# EAGLE design TR_i3_6A_Module_v5 (EAGLE 9.4.1)
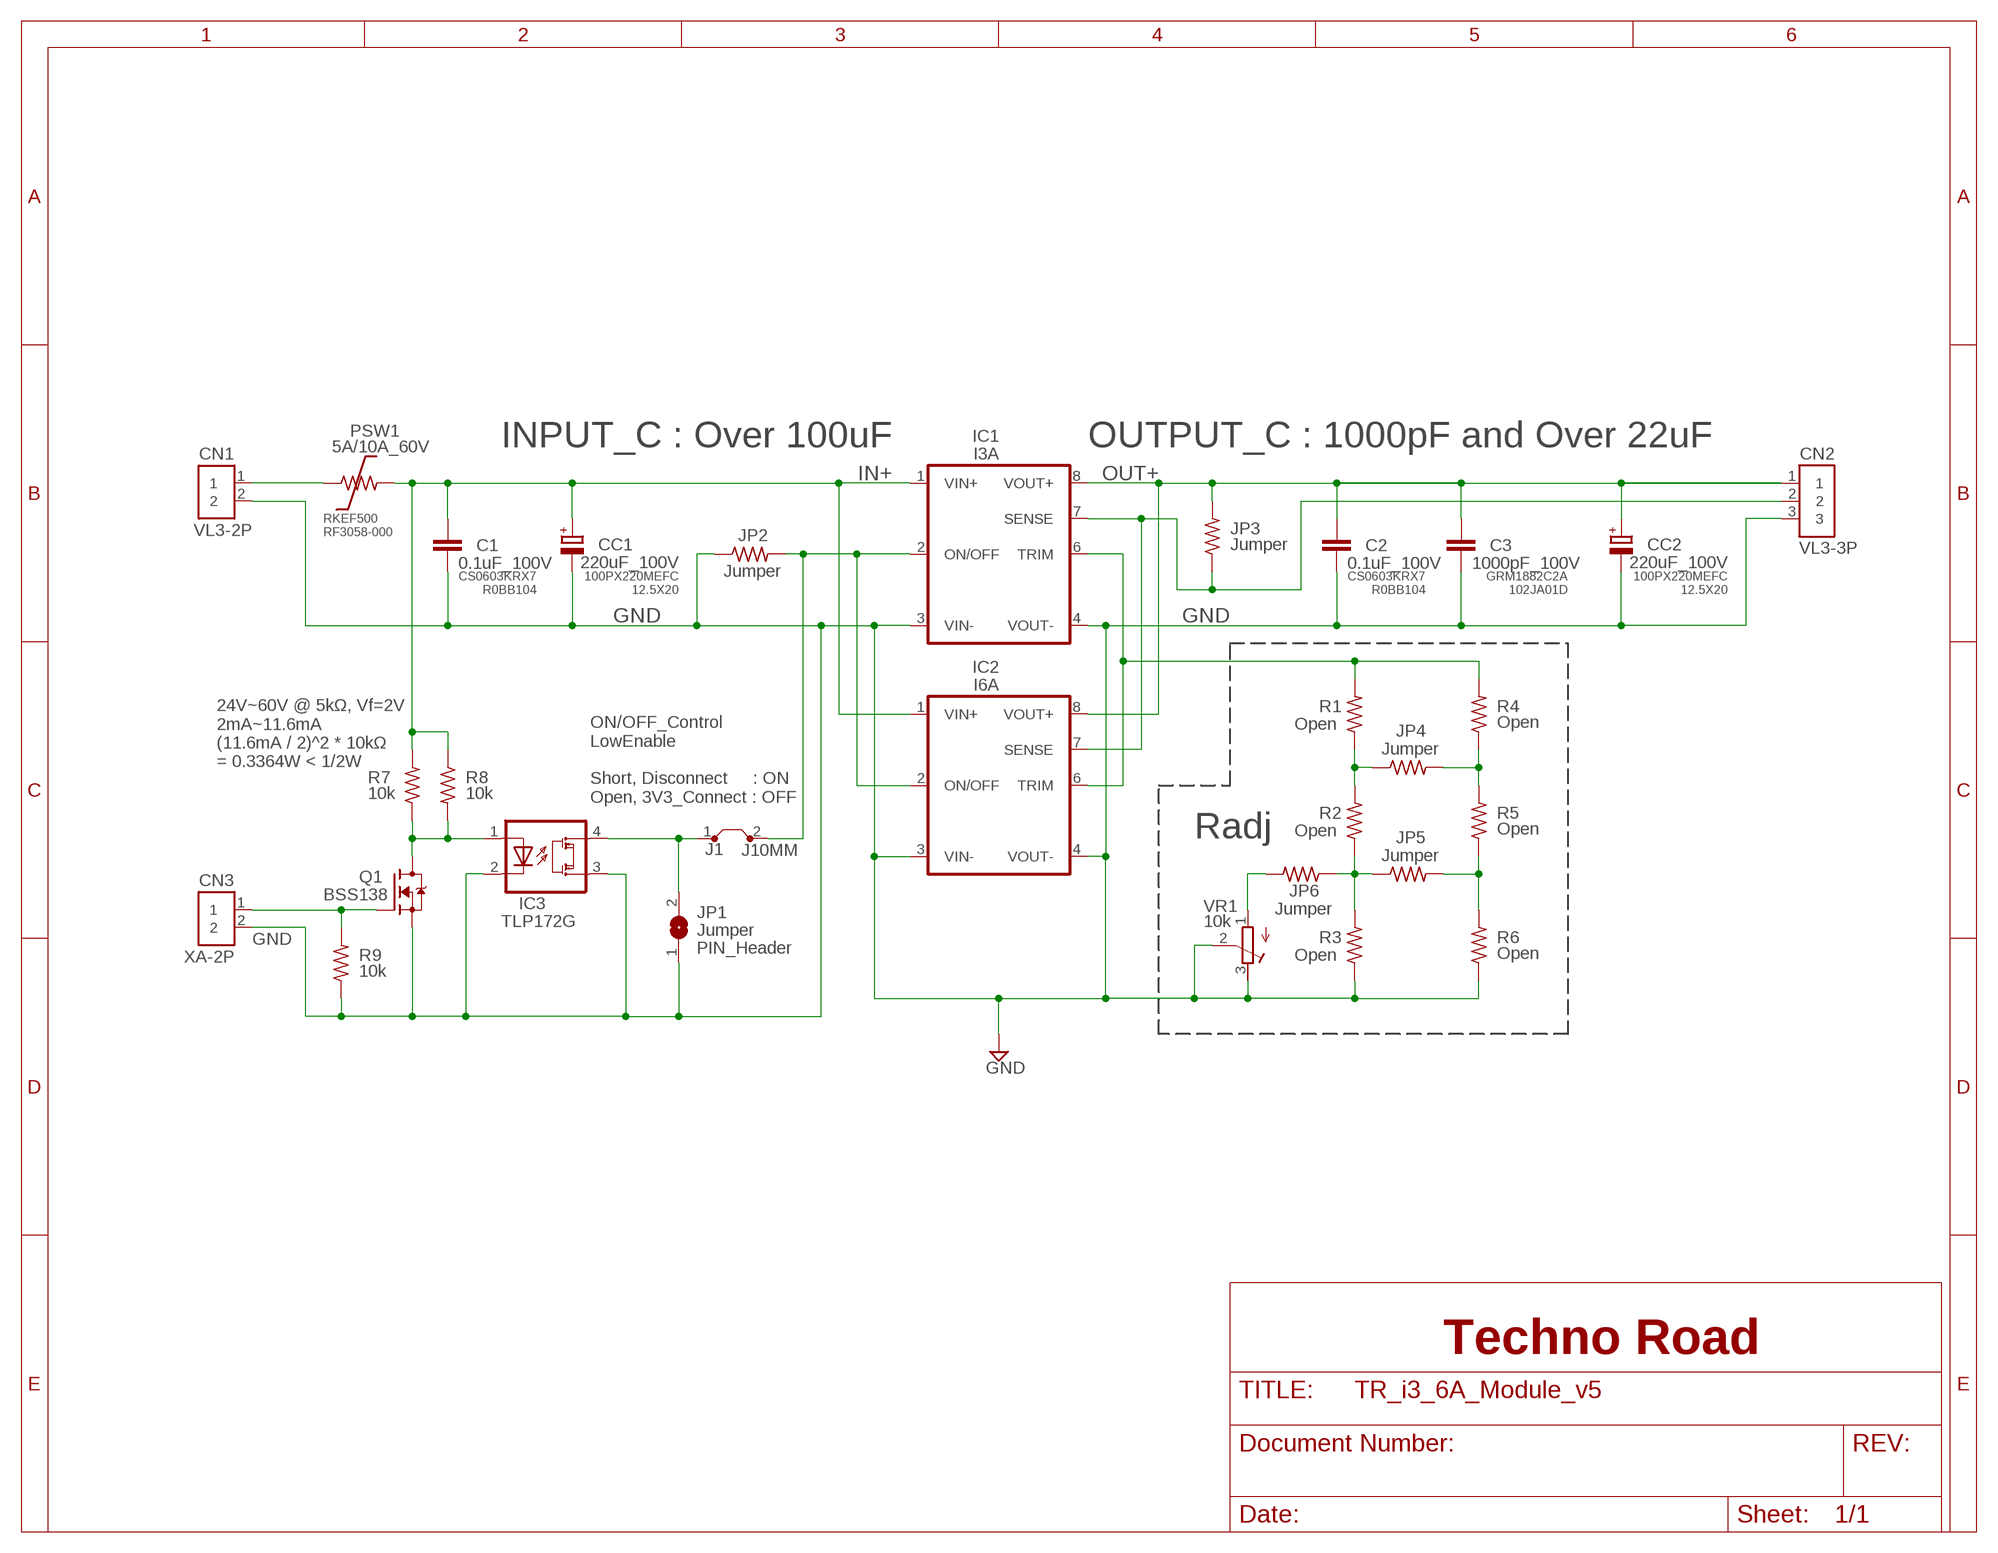
[diagram p0: schematic, sheet 1]

## Parts
C1  0.1uF_100V  C1608  [C1608]
C2  0.1uF_100V  C1608  [C1608]
C3  1000pF_100V  C1608  [C1608]
CC1  220uF_100V  CC0510  [CC0510]
CC2  220uF_100V  CC0510  [CC0510]
CN1  VL3-2P  2PVL3  [VL3-2P]
CN2  VL3-3P  3PVL3  [VL3-3P]
CN3  XA-2P  2PXA_NH  [XA-2P_NH]
IC1  I3A  I3A/I6A_SEREISI3A  [I3A_SERIES]
IC2  I6A  I3A/I6A_SEREISI6A  [I6A_SERIES]
IC3  TLP172G  TLP172  [11-5H1]
J1  J10MM  [10]
JP1  Jumper  JP1D  [JP1D_HOLE]
JP2  Jumper  R1608_LARGE_PAD  [R1608_LARGE_PAD]
JP3  Jumper  R1608_LARGE_PAD  [R1608_LARGE_PAD]
JP4  Jumper  R1608_LARGE_PAD  [R1608_LARGE_PAD]
JP5  Jumper  R1608_LARGE_PAD  [R1608_LARGE_PAD]
JP6  Jumper  R1608_LARGE_PAD  [R1608_LARGE_PAD]
PSW1  5A/10A_60V  PSW10.16MM_4MM  [PSW-10.16MM_4MM]
Q1  BSS138  [SOT-23-3]
R1  Open  R1608_LARGE_PAD  [R1608_LARGE_PAD]
R2  Open  R1608_LARGE_PAD  [R1608_LARGE_PAD]
R3  Open  R1608_LARGE_PAD  [R1608_LARGE_PAD]
R4  Open  R1608_LARGE_PAD  [R1608_LARGE_PAD]
R5  Open  R1608_LARGE_PAD  [R1608_LARGE_PAD]
R6  Open  R1608_LARGE_PAD  [R1608_LARGE_PAD]
R7  10k  R-US_0204/2V  [0204V]
R8  10k  R-US_0204/2V  [0204V]
R9  10k  R1608_LARGE_PAD  [R1608_LARGE_PAD]
VR1  10k  R-TRIM3361P  [3361P]

## Nets
GND: C1.2 C2.2 C3.2 CC1.- CC2.- CN1.2 CN2.3 CN3.2 IC1.3(VIN-) IC1.4(VOUT-) IC2.3(VIN-) IC2.4(VOUT-) IC3.2(C1) IC3.3(DRN1) JP1.1 JP2.1 Q1.2(S) R3.1 R6.1 R9.1 VR1.2(S) VR1.3(E)
IN+: C1.1 CC1.+ IC1.1(VIN+) IC2.1(VIN+) PSW1.2 R7.2 R8.1
N$2: JP4.1 R1.1 R2.2
N$3: JP5.1 JP6.1 R2.1 R3.2
N$4: IC3.4(DRN2) J1.1 JP1.2
N$5: CN2.2 IC1.7(SENSE) IC2.7(SENSE) JP3.1
N$6: IC1.2(ON/OFF) IC2.2(ON/OFF) J1.2 JP2.2
N$7: IC1.6(TRIM) IC2.6(TRIM) R1.2 R4.2
N$8: JP4.2 R4.1 R5.2
N$9: JP5.2 R5.1 R6.2
N$10: IC3.1(A1) Q1.3(D) R7.1 R8.2
N$11: CN1.1 PSW1.1
N$12: JP6.2 VR1.1(A)
N$13: CN3.1 Q1.1(G) R9.2
OUT+: C2.1 C3.1 CC2.+ CN2.1 IC1.8(VOUT+) IC2.8(VOUT+) JP3.2

## Notes on the sheet
- INPUT_C : Over 100uF | OUTPUT_C : 1000pF and Over 22uF
- RKEF500
  RF3058-000
- CS0603KRX7
  R0BB104
- 100PX220MEFC
  12.5X20
- CS0603KRX7
  R0BB104
- GRM1882C2A
  102JA01D
- 100PX220MEFC
  12.5X20
- 24V~60V @ 5kΩ, Vf=2V
  2mA~11.6mA
  (11.6mA / 2)^2 * 10kΩ
  = 0.3364W < 1/2W
- ON/OFF_Control
  LowEnable
  
  Short, Disconnect     : ON
  Open, 3V3_Connect : OFF
- Radj
- PIN_Header
- Techno Road

## Library data of the parts
C1-C3 = my_rcl:C
CC1 CC2 = my_rcl:CC
CN1 CN3 = my_con:2P
CN2 = my_con:3P
IC1 IC2 = my_reg:I3A/I6A_SEREIS
IC3 = Original_Library:TLP172
J1 = my_jumper:J: Bridge
JP1 = my_jumper:JP1D
JP2-JP6 R1-R6 R9 = my_rcl:R
PSW1 = Original_Library:PSW
Q1 = my_tr:BSS138
R7 R8 = rcl:R-US_: RESISTOR, American symbol
VR1 = my_rcl:R-TRIM

## Board
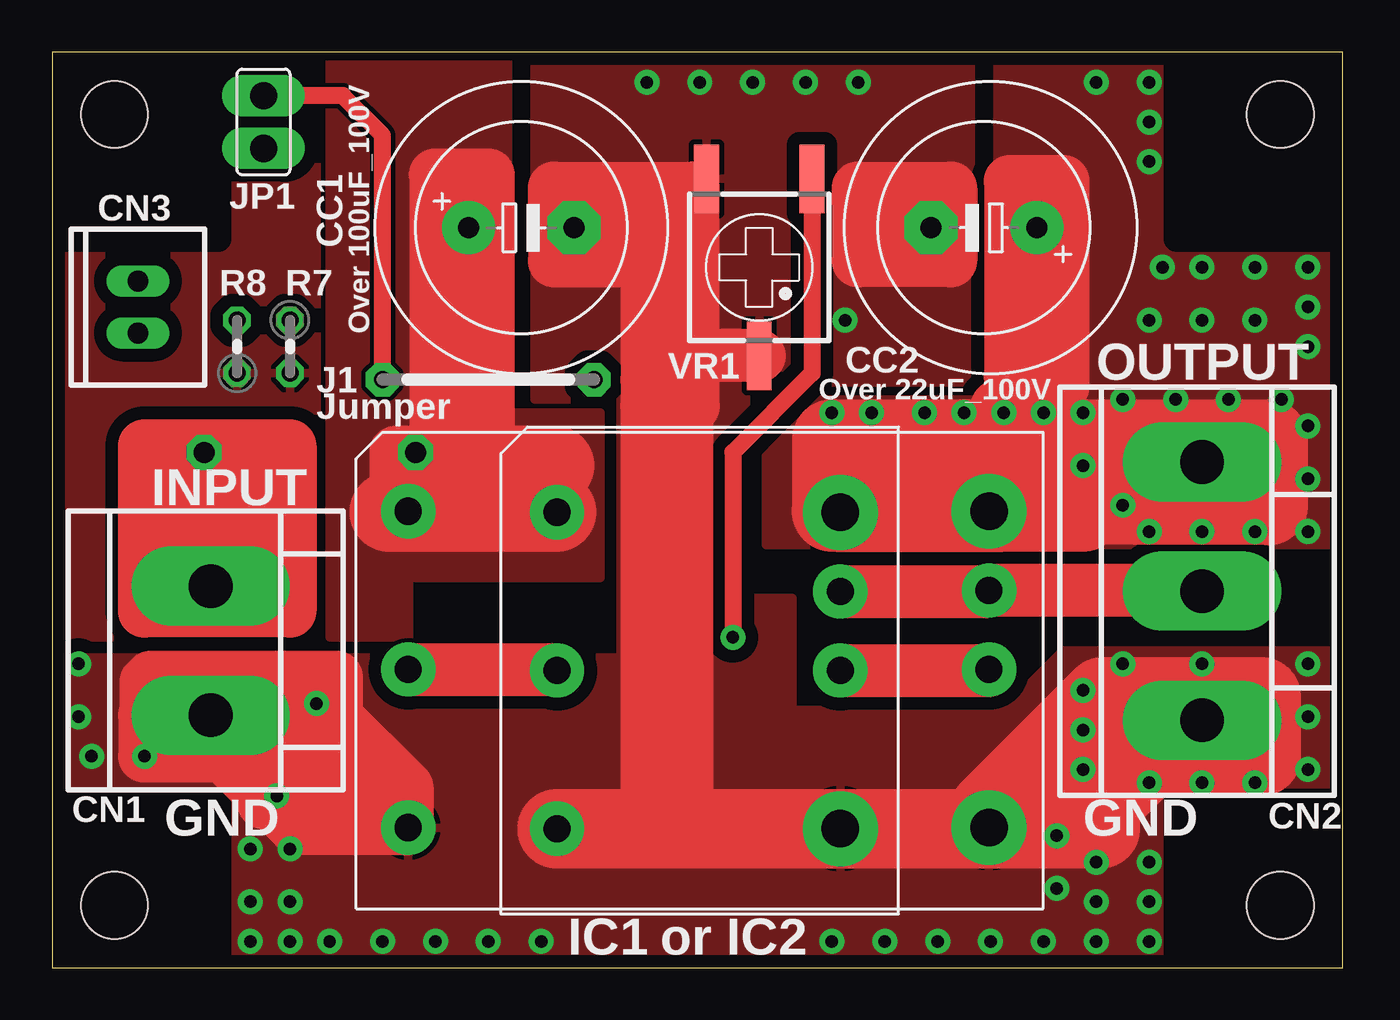
[diagram p1: board, top side]
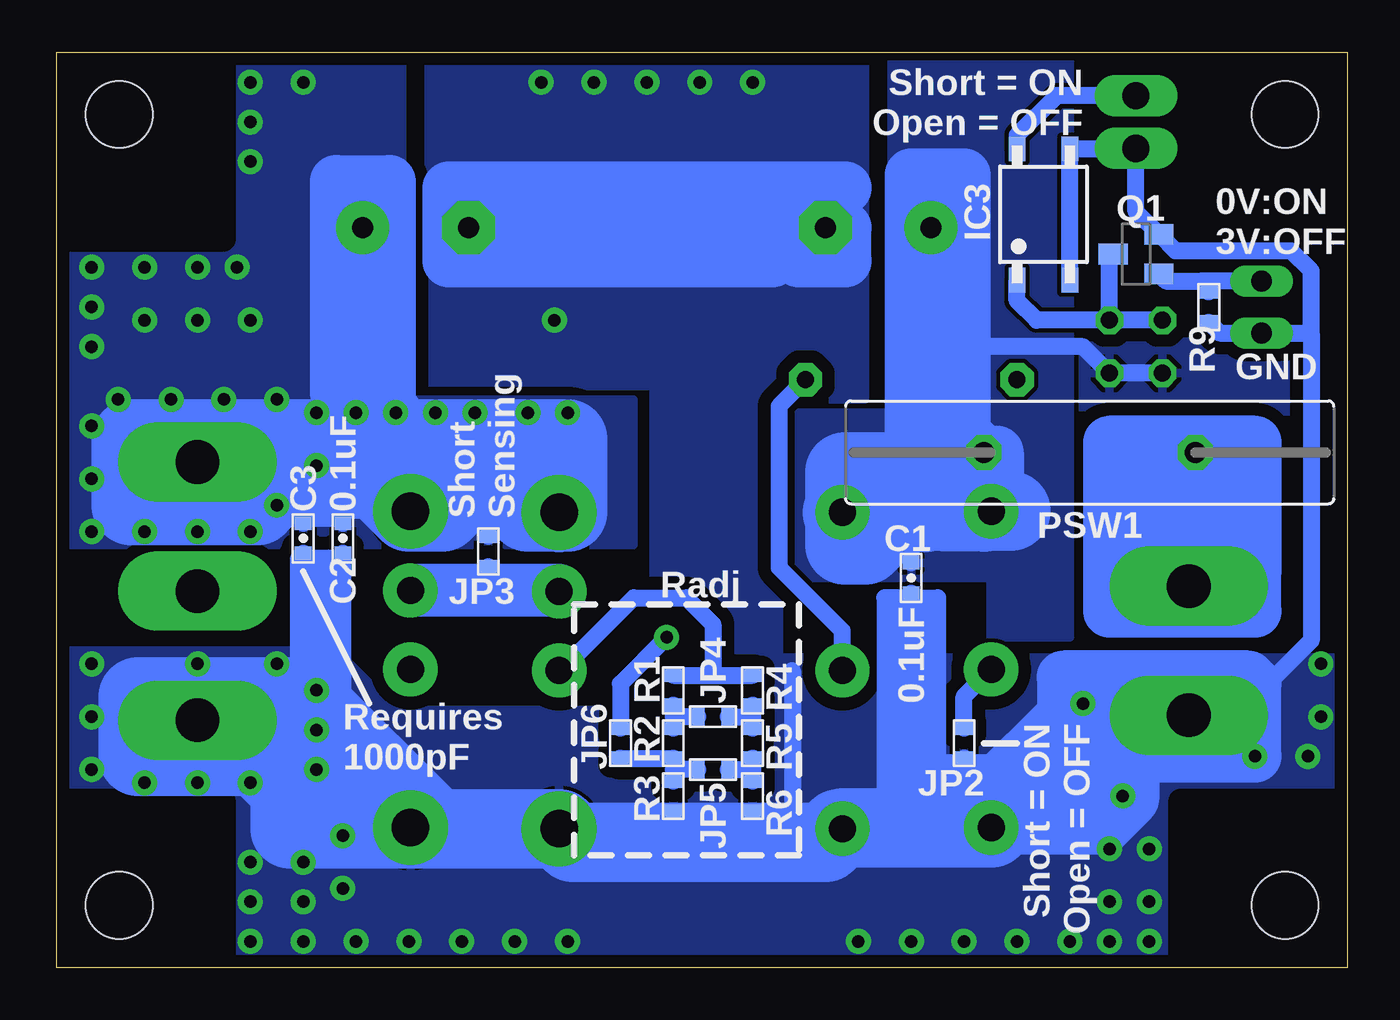
[diagram p2: board, bottom side, seen from below]

Size 62 x 44 mm. Coordinates in mm from the lower left corner, seen from the top.
Outline: 0,0 62,0 62,44 0,44 0,0
Copper layers (1*16): Top 0.035mm / dielectric 1.5mm / Bottom 0.035mm
Design rules "forSmallBoard_20191021_35um": minimum track width 0.2mm, minimum drill 0.25mm, track to track 0.2mm, track to pad 0.2mm, pad to pad 0.2mm, via to via 0.2mm, smd to smd 0mil, copper to edge 0.4mm, drill to drill 6mil, minimum pad ring 10mil, minimum via ring 5mil, stop-mask expansion 4mil, vias tented up to drill 0.5mm, thermal gap 10mil
Holes 3.2 mm at 3,3 59,3 59,41 3,41
tRestrict: area -1,-1 to 8,8; area -1,35 to 8,45; area 54,35 to 63,45; area 54,-1 to 63,8
bRestrict: area -1,-1 to 8,8; area -1,35 to 8,45; area 54,35 to 63,45; area 54,-1 to 63,8

### Footprints (pad centres in the part's own frame; a part is rotated, then mirrored left to right if it is on the bottom)
C1608 = smd 0.65 x 0.8: 1 -0.725,0; 2 0.725,0
CC0510 = drill 1.016 pad 2.54: + -2.54,0 | drill 1.016 pad 2.54 octagon: - 2.54,0
VL3-2P = drill 2.1 pad 3.81 long: 1 -3.1,0; 2 3.1,0
VL3-3P = drill 2.1 pad 3.81 long: 1 -6.2,0; 2 0,0; 3 6.2,0
XA-2P_NH = drill 1 long: 1 1.25,0; 2 -1.25,0
I3A_SERIES = drill 1.3 pad 2.6: 1 -6.85,7.6; 2 -6.85,0; 3 -6.85,-7.6; 6 6.75,0; 7 6.75,3.8 | drill 1.8 pad 3.6: 4 6.75,-7.6; 8 6.75,7.6
I6A_SERIES = drill 1.3 pad 2.6: 1 -14,7.65; 2 -14,0.05; 3 -14,-7.55; 6 13.9,0.05; 7 13.9,3.85 | drill 1.8 pad 3.6: 4 13.9,-7.55; 8 13.9,7.65
11-5H1 = smd 0.8 x 1.2: 1 -1.27,-3.15; 2 1.27,-3.15; 3 1.27,3.15; 4 -1.27,3.15
10 = drill 0.813 pad 1.6 octagon: 1 -5.08,0; 2 5.08,0
JP1D_HOLE = drill 1.3 pad 2 long: 1 -1.27,0; 2 1.27,0
R1608_LARGE_PAD = smd 0.65 x 0.9: 1 -0.725,0; 2 0.725,0
PSW-10.16MM_4MM = drill 1 pad 1.676 octagon: 1 -5.08,0; 2 5.08,0
SOT-23-3 = smd 1 x 1.4: 1 -0.95,-1.1; 2 0.95,-1.1; 3 0,1.1
0204V = drill 0.813 octagon: 1 -1.27,0; 2 1.27,0
3361P = smd 1.2 x 3.3: 1 -2.54,-4.25; 2 0,4.25; 3 2.54,-4.25

### Placement (x,y rotation side)
C1  20.95,18.73 270 bottom
C2  48.26,20.64 270 bottom
C3  50.16,20.64 270 bottom
CC1  22.54,35.56 0 top
CC2  44.77,35.56 180 top
CN1  7.62,15.24 270 top
CN2  55.24,18.1 270 top
CN3  4.13,31.75 90 top
IC1  31.11,14.29 0 top
IC2  31.11,14.29 0 top
IC3  14.61,36.2 0 bottom
J1  20.95,28.26 0 top
JP1  10.16,40.64 90 top
JP2  18.41,10.79 90 bottom
JP3  41.27,20 90 bottom
JP4  30.48,12.06 0 bottom
JP5  30.48,9.53 0 bottom
JP6  34.92,10.79 90 bottom
PSW1  12.38,24.77 180 bottom
Q1  10.16,34.29 90 bottom
R1  32.38,13.34 90 bottom
R2  32.38,10.79 90 bottom
R3  32.38,8.26 90 bottom
R4  28.57,13.34 90 bottom
R5  28.57,10.79 90 bottom
R6  28.57,8.26 90 bottom
R7  11.43,29.84 270 top
R8  8.89,29.84 90 top
R9  6.67,31.75 90 bottom
VR1  33.97,33.66 180 top

### Tracks (layer width: path | path; a pad name or v marks a point on that pad's centre or on a via)
GND  (via drill 0.6 pad 1.2)
  Top 0.813: VR1.2 32.07,29.41 27.09,34.39 30.6,37.91 | VR1.3 30.6,37.91 | 30.8,37.47 30.8,37.71 30.6,37.91
  Top 2.54: 28.89,6.67 30.8,6.67 | 30.8,6.67 32.38,6.67 | 28.57,35.88 28.57,26.99 30.8,26.99 30.8,37.47 24.13,37.47 24.13,34.92 25.4,33.97 | CC1.- 24.13,34.61 24.13,33.97 25.4,33.97 | CC1.- 25.08,34.29 25.4,33.97 | 25.4,33.97 27.62,33.97 27.62,35.88 25.4,35.88 CC1.- | VR1.2 30.48,29.41 30.48,6.99 30.8,6.67 | 28.57,28.26 28.57,6.69 | 38.73,36.83 38.73,37.47 43.18,37.47 43.18,33.97 38.73,33.97 38.73,36.83 | CC2.- 42.55,35.24 41.2,34.37 38.73,36.83 | CN1.2 4.52,12.14 4.52,13.73 4.76,13.97 13.65,13.97 13.65,12.06 17.05,8.67 17.05,6.67 | IC2.3 17.05,6.67 | 17.05,6.67 11.75,6.67 8.26,10.16 v4.45,10.16 4.45,12.14 CN1.2 | CN1.2 12.06,12.14 12.06,7.94 10.16,7.94 10.16,11.11 13.34,11.11 13.34,7.94 15.56,7.94 15.56,9.21 10.79,9.21 10.79,12.14 CN1.2
  Top 3.81: CN2.3 45,7.54 50.35,12.89 | 50.48,13.02 50.48,7.94 52.7,10.16 58.1,10.16 58.1,13.02 50.48,13.02 | 50.48,13.02 50.35,12.89 | 50.35,12.89 50.35,6.69 IC1.4 28.57,6.69 IC1.3
  Bottom 0.813: IC1.4 33.23,6.69 R3.1 R6.1 27.73,6.69 26.67,6.69 | 26.67,6.69 IC1.3 | 49.21,11.57 45.02,7.37 IC2.4 | CN2.3 49.21,11.9 49.21,19.59 | C3.2 49.85,19.59 | 49.85,19.59 49.21,19.59 | 50.16,19.59 50.08,19.68 48.26,19.68 48.26,13.02 48.9,13.65 48.9,19.68 49.85,19.59 | 49.21,19.59 48.58,19.59 C2.2 | JP2.1 18.19,9.84 | 18.19,9.84 16.83,9.84 14.53,12.14 13.65,12.14 11.43,12.14 9.84,12.14 CN1.2 5.32,12.14 1.74,15.72 1.74,30.48 | 18.19,9.84 19.68,9.84 19.37,9.53 19.37,8.89 19.05,8.57 17.78,8.57 17.78,9.21 18.73,9.21 18.41,8.04 IC2.3 20.39,6.74 20.95,7.3 20.95,17.46 21.59,17.46 21.59,8.57 20.32,8.57 20.32,17.14 19.68,17.78 | C1.2 20.73,17.78 | 20.73,17.78 19.68,17.78 | 20.73,17.78 22.23,17.78 22.23,7.94 19.68,7.94 19.68,17.78 | 1.74,30.48 1.74,33.49 2.7,34.45 8.26,34.45 9.05,35.24 Q1.2 10.16,36.34 JP1.1 10.19,39.34 IC3.3 IC3.2 | 26.67,14.29 26.67,6.69 | 1.74,30.48 1.76,30.5 CN3.2 6.14,30.5 R9.1
  Bottom 1.27: 50.16,13.02 50.16,19.59
  Bottom 2.54: CC1.- 25.08,36.2 25.24,36.35 24.13,37.47 43.18,37.47 43.18,35.56 CC2.- 41.27,35.56 41.27,33.97 | 26.35,33.97 24.13,33.97 24.13,35.56 41.59,35.56 43.18,33.97 | 43.18,33.97 41.27,33.97 | 41.27,33.97 43.18,35.88 43.18,33.97 | 41.27,33.97 27.62,33.97 | 13.65,12.14 13.65,13.97 4.76,13.97 4.45,13.65 v4.45,10.16 10.32,10.16 10.32,8.1 11.68,6.74 IC2.3 | 13.65,12.14 17.22,8.57 17.78,8.57 | IC2.3 16.83,6.74 11.43,12.14 | IC2.3 15.24,6.74 9.84,12.14 | IC2.3 13.02,6.74 CN1.2 | IC2.3 16.76,6.74 12.06,11.43 | IC2.3 13.65,10.2 13.65,12.14 | IC2.3 16.44,6.74 13.65,9.53
  Bottom 3.81: IC2.3 24.21,6.74 IC1.3 24.43,6.69 25.08,6.03 37.21,6.03 IC1.4 44.97,6.69 IC2.4 50.8,12.52 50.8,13.02 | 55.24,13.02 58.1,13.02 58.1,10.16 52.07,10.16 50.8,8.89 50.8,8.57 | 50.8,13.02 50.16,13.02 43.81,6.67 50.8,6.67 50.8,8.57 | 51.75,9.53 50.8,8.57 | 50.8,13.02 55.24,13.02 | 55.24,13.02 CN2.3
  other vias: 31.11,42.55 33.66,42.55 36.2,42.55 38.1,31.11 10.79,8.26 11.43,5.71 9.53,5.71 9.53,3.17 11.43,3.17 9.53,1.27 11.43,1.27 13.34,1.27 1.91,10.16 1.27,12.06 1.27,14.61 12.7,12.7 15.88,1.27 18.41,1.27 20.95,1.27 23.5,1.27 37.47,1.27 40.01,1.27 42.55,1.27 45.09,1.27 47.62,1.27 50.16,1.27 52.7,1.27 52.7,3.17 52.7,5.08 50.16,5.08 50.16,3.17 48.26,6.35 48.26,3.81 49.53,9.53 49.53,11.43 49.53,13.34 51.44,14.61 60.33,14.61 60.33,12.06 60.33,9.53 55.24,8.89 55.24,14.61 52.7,8.89 57.78,8.89 38.73,42.55 28.57,42.55
  pour Top (isolate 0.61): -0.64,14.92 27.3,14.92 27.3,27.3 23.18,27.3 23.18,44.45 44.13,44.45 44.13,27.94 33.34,27.94 33.34,17.78 35.56,17.78 35.56,12.38 45.72,12.38 48.58,15.24 62.23,15.24 62.23,-0.32 -0.64,-0.32
  pour Bottom (isolate 0.61): -0.64,14.92 27.3,14.92 27.3,27.3 23.18,27.3 23.18,44.45 44.13,44.45 44.13,27.94 33.34,27.94 33.34,17.78 35.56,17.78 35.56,12.38 45.72,12.38 48.58,15.24 62.23,15.24 62.23,-0.32 -0.64,-0.32
IN+
  Top 2.54: 20,38.1 18.41,38.1 18.41,24.45 19.05,24.45 19.05,31.75 18.73,31.75 20,33.02 CC1.+ 20,38.1 | 20,38.1 20.95,38.1 20.95,21.91 | 20.95,21.91 20,21.91 | 20.95,21.91 24.25,21.91 | PSW1.2 16.51,24.77 16.51,21.91 16.19,21.91
  Top 3.81: 22.86,23.5 22.23,24.13 24.13,24.13 | 16.19,21.91 24.25,21.91
  Bottom 0.813: C1.1 20.95,21.94 | 20.95,22.54 23.61,22.54 IC1.1 | R8.1 R7.2 12.7,29.84 18.41,29.84
  Bottom 2.54: CC1.+ 20,38.1 18.41,38.1 18.41,29.84 18.41,22.54 20.95,22.54 20.95,38.1 19.05,38.1 19.05,26.35 PSW1.2 16.83,24.77 16.83,22.23 IC2.1
  Bottom 3.81: IC2.1 16.8,21.94 | 20.95,21.94 16.16,21.94 | 21.59,21.94 17.45,21.9 | 19.68,23.18 19.05,23.81 24.13,23.81 24.13,20.32 23.18,20.32 21.59,21.91 20.32,21.91 20.32,21.89 IC1.1
  pour Bottom (isolate 0.61): -0.64,15.88 12.7,15.88 12.7,44.45 -0.64,44.45
  pour Top (isolate 0.61): -0.64,44.45 -0.64,15.88 12.7,15.88 12.7,44.45
  pour Bottom: 13.34,15.88 17.14,15.88 17.14,18.73 26.35,18.73 26.35,26.67 21.91,26.67 21.91,44.45 13.34,44.45
  pour Top: 13.34,44.45 13.34,15.88 17.14,15.88 17.14,18.73 26.35,18.73 26.35,26.67 21.91,26.67 21.91,44.45
N$2
  Bottom 0.813: R1.1 32.38,12.06 | 32.38,12.06 R2.2 | JP4.1 32.38,12.06
N$3
  Bottom 0.813: 32.38,9.53 R2.1 JP6.1 | 32.38,9.53 R3.2 | JP5.1 32.38,9.53
N$4
  Top 0.813: J1.1 15.88,40.01 13.97,41.91 JP1.2
  Bottom 0.813: JP1.2 13.97,41.91 15.88,40.01 IC3.4
N$5
  Top 2.54: IC1.7 44.97,18.09 IC2.7 55.2,18.14 CN2.2
  Bottom 0.813: 37.91,18.14 41.27,18.14 | 41.27,18.14 IC2.7 | JP3.1 41.27,18.14
  Bottom 2.54: IC1.7 37.91,18.14 IC2.7
N$6
  Top 2.54: IC2.2 24.21,14.34 IC1.2
  Bottom 0.813: JP2.2 18.41,13.04 IC2.2 | IC1.2 24.27,16.19 27.3,19.23 27.3,26.99 J1.2
N$7
  Top 2.54: IC1.6 44.97,14.29 IC2.6
  Bottom 0.813: R1.2 30.48,14.06 | 30.48,14.06 R4.2 | IC1.6 37.78,14.29 34.29,17.78 31.75,17.78 30.48,16.51 30.48,14.06
N$8
  Bottom 0.813: R4.1 28.57,12.06 | 28.57,12.06 R5.2 | JP4.2 28.57,12.06
N$9
  Bottom 0.813: R5.1 28.57,9.53 | 28.57,9.53 R6.2 | JP5.2 28.57,9.53
N$10
  Bottom 0.813: R8.2 R7.1 | R7.1 11.43,34.12 Q1.3 | R7.1 14.92,31.11 15.88,32.07 IC3.1
N$11
  Top 2.54: 7.3,25.08 11.43,25.08 11.43,17.14 4.45,17.14 4.45,24.13 | 4.45,24.13 4.45,25.08 7.3,25.08 | 7.3,25.08 PSW1.1 | 4.45,24.13 6.03,24.13 6.03,18.41 9.53,18.41 9.53,23.5 7.62,23.5 CN1.1
  Bottom 2.54: PSW1.1 6.99,25.08 4.45,25.08 | 4.45,25.08 4.45,25.25 11.43,25.25 11.43,17.14 4.45,17.14 4.45,19.05 | 4.45,25.08 4.45,19.05 | CN1.1 7.62,21.91 8.26,21.91 8.26,20 6.03,20 6.03,23.5 9.84,23.5 9.84,19.05 4.45,19.05
N$12  (via drill 0.6 pad 1.2)
  Top 0.813: VR1.1 36.51,28.57 32.7,24.77 v32.7,15.88
  Bottom 0.813: v32.7,15.88 34.92,13.65 JP6.2
N$13
  Bottom 0.813: Q1.1 8.72,33 7,33 | CN3.1 7,33 | R9.2 6.67,32.66 7,33
OUT+  (via drill 0.6 pad 1.2)
  Top 2.54: 46.04,28.43 50.16,24.3 50.48,23.98 | CC2.+ 47.31,37.78 | 46.04,28.43 46.04,27.94 | 46.04,27.94 46.04,26.99 45.4,26.99 45.4,26.04 | 46.04,27.94 48.58,27.94 48.58,37.78 47.31,37.78 | 47.31,37.78 46.04,37.78 46.04,28.43
  Top 3.81: CN2.1 50.16,24.3 | 50.48,23.98 47.58,23.98 45.48,21.89 IC1.8 37.91,21.94 37.44,21.94 37.47,21.91 | 37.47,25.4 37.47,21.91 | 37.47,21.91 49.53,21.91 50.48,22.86 | 50.48,22.86 51.12,22.86 | 50.48,22.86 40.01,22.86 37.47,25.4 | 37.47,25.4 58.42,25.4 58.42,22.23 45.33,22.25 IC2.8
  Bottom 0.813: 37.91,21.94 41.27,21.94 | 41.27,21.94 IC2.8 | JP3.2 41.27,21.94 | 47.06,23.98 48.26,23.98 | 48.26,23.98 50.16,23.98 | CN2.1 50.16,24.3 50.16,23.98 | C2.1 48.49,21.59 50.16,21.59 49.85,21.91 48.26,21.91 | 48.26,21.91 48.26,21.59 | 48.26,21.91 48.26,23.98 | C3.1 50.16,23.98
  Bottom 2.54: CC2.+ 46.35,35.56 46.35,27.3 v45.72,26.67 v47.62,26.67 48.58,27.62 48.58,37.78 46.04,37.78 46.04,22.12 45.4,22.32 IC2.8
  Bottom 3.81: IC1.8 37.88,21.91 | 37.91,21.94 37.88,21.91 | 37.88,21.91 39.37,21.91 | 37.88,21.91 37.47,21.91 37.47,25.4 58.42,25.4 58.42,22.23 52.39,22.23 51.12,23.5 46.67,23.5 45.09,21.91 43.5,21.91 42.55,22.86 | 41.27,22.86 43.5,22.86 IC2.8 47.06,23.98 47.38,24.3 CN2.1
  other vias: 37.47,26.67 39.37,26.67 41.91,26.67 43.81,26.67 49.53,26.67 49.53,24.13 51.44,27.3 53.98,27.3 56.52,27.3 59.05,27.3 60.33,26.04 60.33,23.5 60.33,20.95 57.78,20.95 55.24,20.95 52.7,20.95 51.44,22.23 52.7,31.11 55.24,31.11 57.78,31.11 60.33,31.75 60.33,29.84 60.33,33.66 57.78,33.66 55.24,33.66 53.34,33.66 52.7,42.55 52.7,40.64 52.7,38.73 50.16,42.55
  pour Top (isolate 0.61): 45.4,44.45 62.23,44.45 62.23,20.32 34.29,20.32 34.29,27.3 45.4,27.3
  pour Bottom (isolate 0.61): 45.4,44.45 62.23,44.45 62.23,20.32 34.29,20.32 34.29,27.3 45.4,27.3

### Text on the board
tNames: Over 100uF_100V | OUTPUT | Over 22uF_100V | Jumper | INPUT | GND | GND | or
bNames: Short = ON / Open = OFF | 0V:ON / 3V:OFF | GND | Short / Sensing | 0.1uF | Radj | 0.1uF | Short = ON / Open = OFF | Requires / 1000pF